# EAGLE design TinyFET (EAGLE 8.2.1)
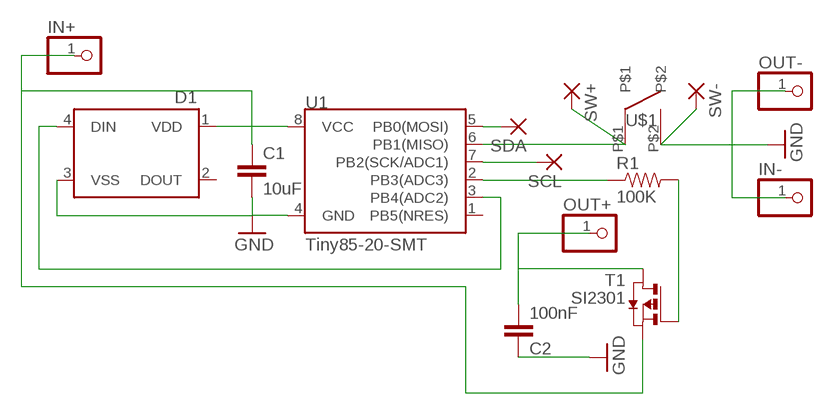
[diagram p0: schematic, sheet 1]

## Parts
C1  10uF  C-EUC0603K  [C0603K]
C2  100nF  C-EUC0603K  [C0603K]
D1  WS2812B  [WS2812B]
IN+  PINHD-1X1  [1X01]
IN-  PINHD-1X1  [1X01]
OUT+  PINHD-1X1  [1X01]
OUT-  PINHD-1X1  [1X01]
R1  100K  RESISTOR0603-RES  [0603-RES]
SCL  SMD2  [SMD1,27-2,54]
SDA  SMD2  [SMD1,27-2,54]
SW+  SMD2  [SMD1,27-2,54]
SW-  SMD2  [SMD1,27-2,54]
T1  SI2301  PMOSSOT23  [SOT-23]
U1  Tiny85-20-SMT  ATTINY45TINY85-20-SMT  [SO08-EIAJ]
U$1  5MMSNAP  [5MMSNAP]

## Nets
5V0@2: C2.2 OUT+.1 T1.1(D)
GND: C1.2 C2.1 D1.3(VSS) IN-.1 OUT-.1 SW-.1(P) U1.4(GND) U$1.P$2
N$1: SCL.1(P) U1.7(PB2(SCK/ADC1))
N$2: SDA.1(P) U1.5(PB0(MOSI))
N$10: R1.2 T1.3(G)
N$11: C1.1 D1.1(VDD) IN+.1 T1.2(S) U1.8(VCC)
N$18: D1.4(DIN) U1.3(PB4(ADC2))
N$20: SW+.1(P) U1.6(PB1(MISO)) U$1.P$1
N$24: R1.1 U1.2(PB3(ADC3))
Unconnected: D1.2(DOUT) U1.1(PB5(NRES))

## Library data of the parts
C1 = resistor:C-EU: CAPACITOR, European symbol
C2 = rcl:C-EU: CAPACITOR, European symbol
D1 = SparkFun-LED:WS2812B: WS2812B - Intelligent control LED integrated light source Technical Specifications: Power Supply Voltage (VDD): 3.5 to 5.3 V Input Voltage (VI): -0.5 to VDD+0.5 V Operating Junction Temperature (Topt): -25°C to +80°C Storage Temperature Range (Tstg): -55°C to +150°C; PROD_ID: DIO-12503
IN+ IN- OUT+ OUT- = pinhead:PINHD-1X1: PIN HEADER
R1 = SparkFun-Passives:RESISTOR: Resistor Basic schematic elements and footprints for 0603, 1206, and PTH resistors.
SCL SDA SW+ SW- = wirepad:SMD2: SMD PAD
T1 = zetex:PMOSSOT23: MOS FET; OC_FARNELL: unknown; OC_NEWARK: unknown
U1 = SparkFun-DigitalIC:ATTINY45: Atmel 8-pin 2/4/8kB flash uC; PROD_ID: IC-09092
U$1 = 5mmSNAP:5MMSNAP

## Board
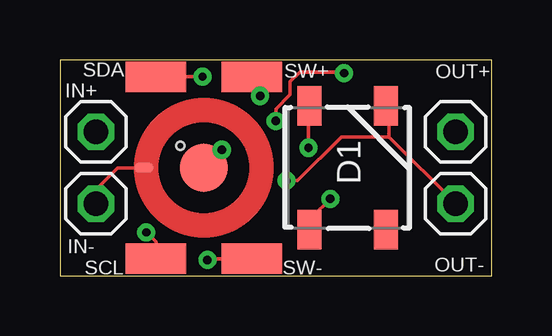
[diagram p1: board, top side]
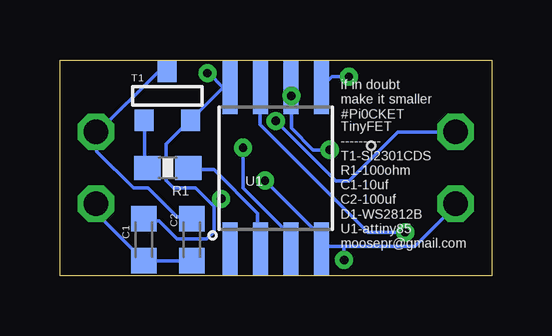
[diagram p2: board, bottom side, seen from below]

Size 18 x 9 mm. Coordinates in mm from the lower left corner, seen from the top.
Outline: 0,0 18,0 18,9 0,9 0,0
Copper layers (1*16): Top 0.035mm / dielectric 1.5mm / Bottom 0.035mm
Design rules "default *": minimum track width 6mil, minimum drill 0.35mm, track to track 6mil, track to pad 6mil, pad to pad 6mil, via to via 6mil, smd to smd 6mil, copper to edge 40mil, drill to drill 6mil, minimum pad ring 10mil, minimum via ring 8mil, stop-mask expansion 4mil, vias tented up to drill 25mil, thermal gap 10mil

### Footprints (pad centres in the part's own frame; a part is rotated, then mirrored left to right if it is on the bottom)
C0603K = smd 1.05 x 1.08: 1 -0.875,0; 2 0.875,0
WS2812B = smd 1.651 x 1: 1 -2.577,1.6; 2 -2.577,-1.6; 3 2.577,-1.6; 4 2.577,1.6
1X01 = drill 1.016 octagon: 1 0,0
0603-RES = smd 1.1 x 1: 1 -0.85,0; 2 0.85,0
SMD1,27-2,54 = smd 1.27 x 2.54: 1 0,0
SOT-23 = smd 0.787 x 0.889: 1 0.025,-1.016; 2 -0.94,1.016; 3 0.991,1.016
SO08-EIAJ = smd 0.61 x 2.21: 1 -1.905,-3.378; 2 -0.635,-3.378; 3 0.635,-3.378; 4 1.905,-3.378; 5 1.905,3.353; 6 0.635,3.353; 7 -0.635,3.353; 8 -1.905,3.353
5MMSNAP = smd 2 x 2: P$1 0,0 | smd 0.813 x 0.406: P$2 -2.5,0 | hole 0.35: -0.98,0.92

### Placement (x,y rotation side)
C1  14.5,1.5 270 bottom
C2  12.5,1.5 90 bottom
D1  12,4.5 90 top
IN+  1.5,6 0 top
IN-  1.5,3 180 top
OUT+  16.5,6 0 top
OUT-  16.5,3 180 top
R1  13.5,4.5 180 bottom
SCL  4,0.7 90 top
SDA  4,8.3 270 top
SW+  8,8.3 270 top
SW-  8,0.7 90 top
T1  13.5,7.5 180 bottom
U1  9,4.5 0 bottom
U$1  6,4.5 0 top

### Tracks (layer width: path | path; a pad name or v marks a point on that pad's centre or on a via)
5V0@2
  Bottom 0.152: 16.46,5.94 16.46,5.18 14.94,3.66 14.33,3.66 13.11,2.44 12.65,2.44 C2.2 | 16.46,5.94 OUT+.1 | T1.1 13.89,8.52 16.46,5.94
GND  (via drill 0.35)
  Top 0.152: 13.72,5.79 13.72,7.01 D1.3 | 13.72,5.79 16.46,3.05 OUT-.1 | 13.72,5.79 11.73,5.79 9.91,3.96 v9.45,3.96 | IN-.1 1.5,3.6 2.4,4.5 U$1.P$2 | SW-.1 6.2,0.7 v6.15,0.65
  Bottom 0.152: 6.15,1.22 3.2,1.22 1.52,2.9 IN-.1 | 6.15,1.22 7.01,1.22 U1.4 7.16,1.22 7.16,1.68 v9.45,3.96 | OUT-.1 16.5,2.62 C1.2 C2.1 | v6.15,0.65 6.15,1.22
N$1  (via drill 0.35)
  Top 0.152: SCL.1 4,1.4 v3.6,1.8
  Bottom 0.152: v3.6,1.8 5.15,1.8 9.65,6.3 9.65,7.84 U1.7
N$2  (via drill 0.35)
  Top 0.152: SDA.1 v5.95,8.3
  Bottom 0.152: v5.95,8.3 6.65,8.3 U1.5
N$10
  Bottom 0.152: T1.3 14.48,6.4 14.48,4.57 R1.2
N$11  (via drill 0.35)
  Top 0.152: v11.28,3.2 10.52,2.44 10.52,1.98 D1.1 | v9,6.45 9,6.95 9.6,7.55 9.6,8.1 10,8.5 11.8,8.5 v11.85,8.45
  Bottom 0.152: 11.58,2.9 11.58,1.83 11.89,1.52 13.11,1.52 13.87,2.29 14.48,2.29 C1.1 | 11.58,2.9 12.34,3.66 13.26,3.66 13.56,3.96 13.56,5.49 12.65,6.4 T1.2 11.19,7.85 | 11.58,2.9 v11.28,3.2 | 11.19,7.85 U1.8 | IN+.1 3.9,6 5.95,3.95 6.5,3.95 v9,6.45 | v11.85,8.45 11.79,8.45 11.19,7.85
N$18  (via drill 0.35)
  Top 0.152: v10.36,5.33 10.36,7.01 D1.4
  Bottom 0.152: v10.36,5.33 10.36,3.66 8.38,1.68 8.38,1.22 U1.3
N$20  (via drill 0.35)
  Top 0.152: U$1.P$1 v6.75,5.25 | SW+.1 8,7.85 v8.35,7.5
  Bottom 0.152: v6.75,5.25 7.45,5.25 8.35,6.15 v8.35,7.5 8.37,7.51 U1.6
N$24
  Bottom 0.152: R1.1 12.65,4.42 11.58,4.42 9.75,2.59 9.75,1.22 U1.2

### Text on the board
bNames: if in doubt / make it smaller / #Pi0CKET | TinyFET / --------- / T1-SI2301CDS / R1-100ohm / C1-10uf / C2-100uf / D1-WS2812B / U1-attiny85 / moosepr@gmail.com